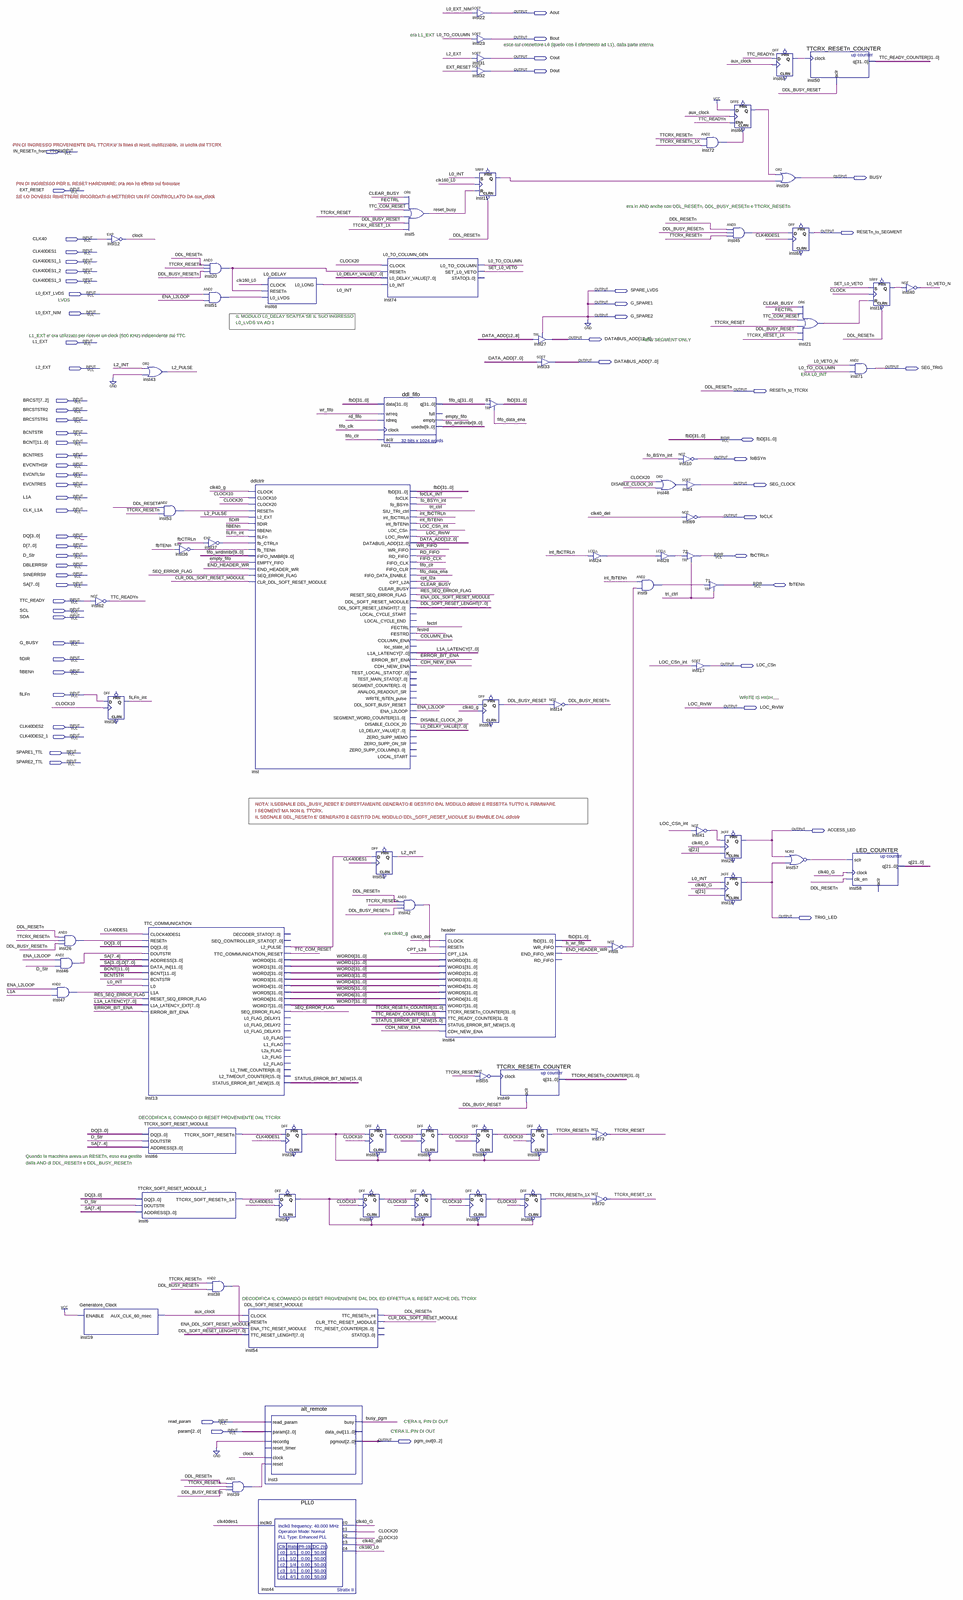
[diagram p0: schematic sheet, whole]
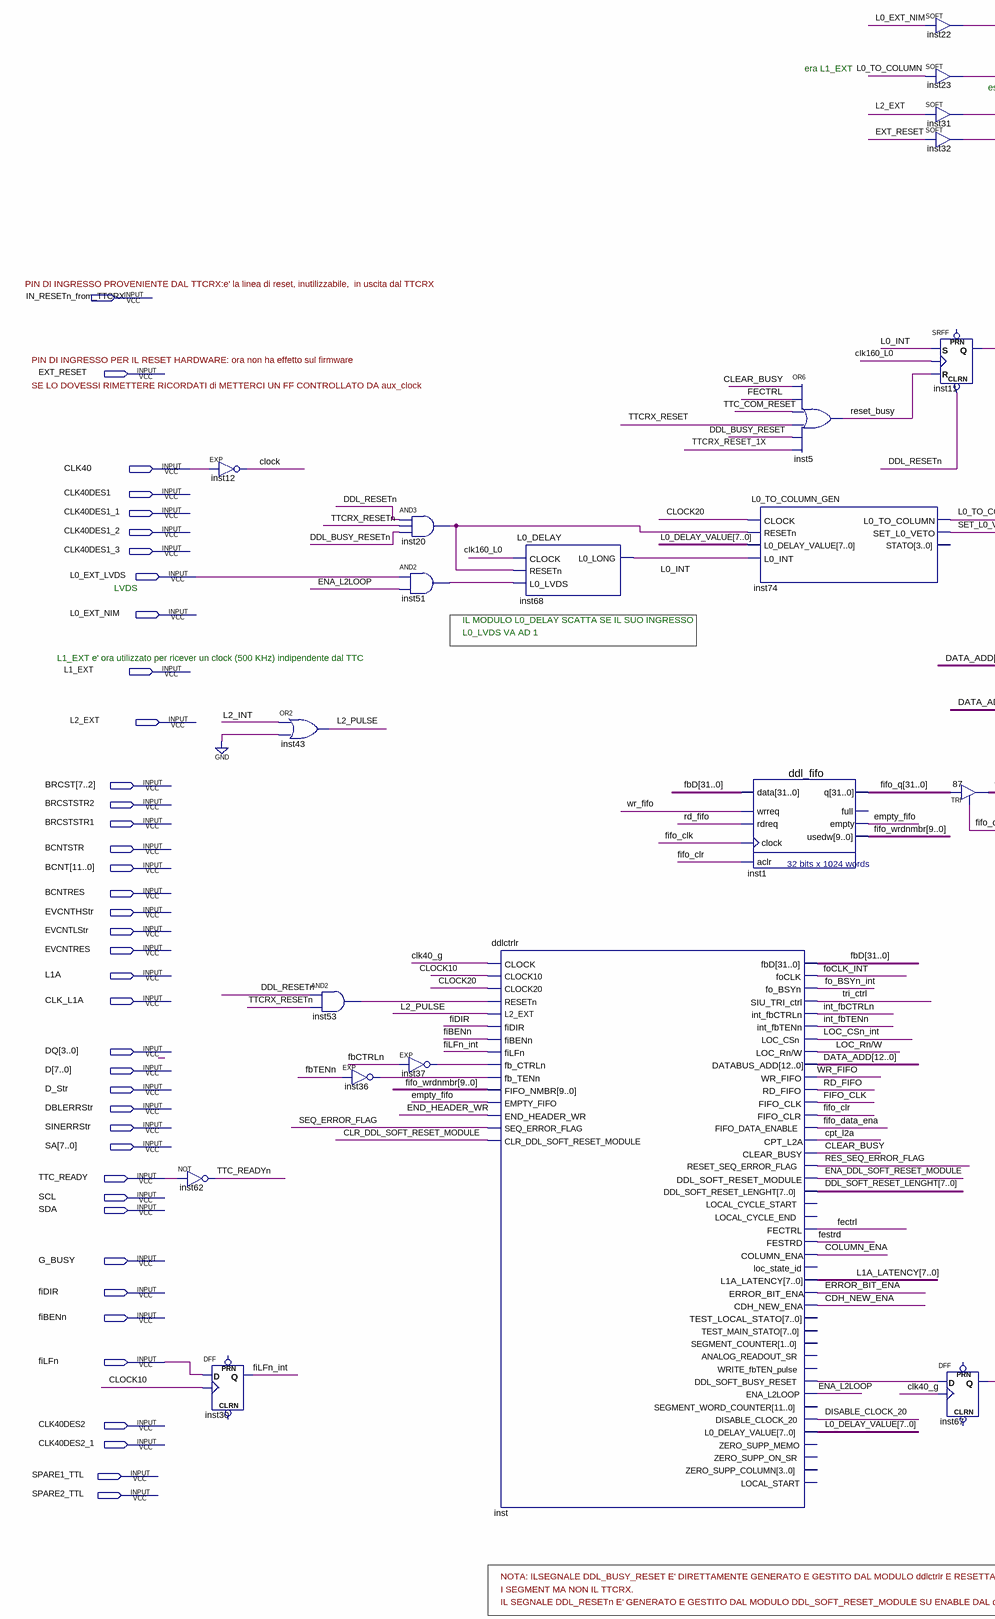
[diagram p1: schematic sheet, upper left part]
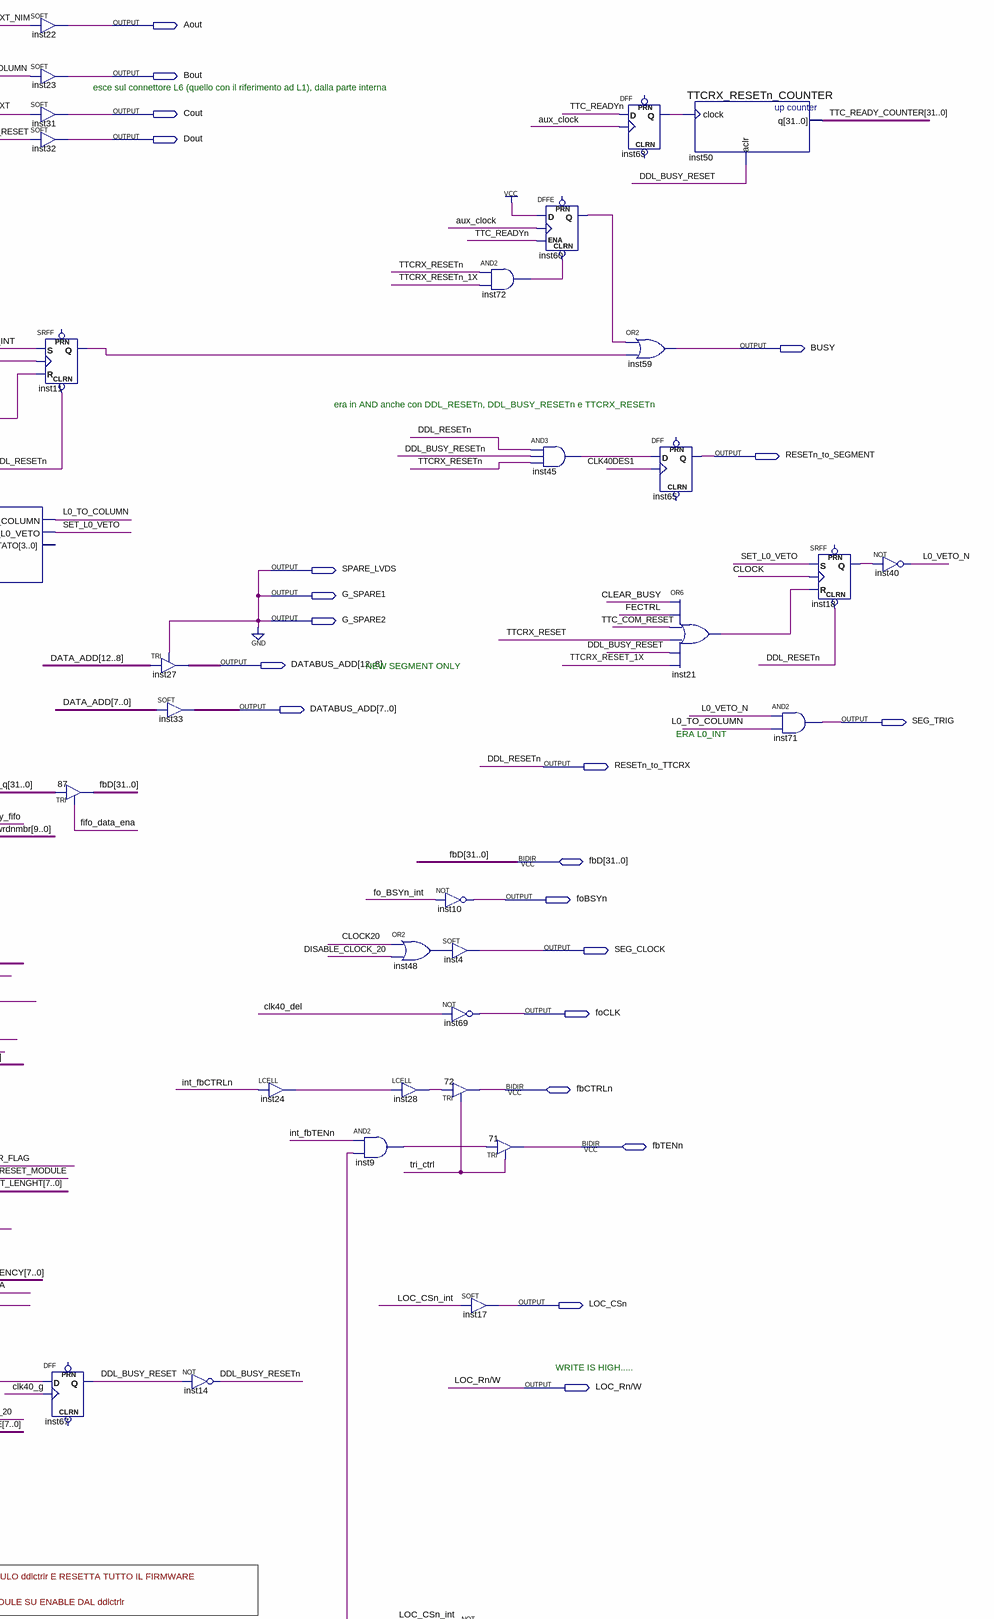
[diagram p2: schematic sheet, upper right part]
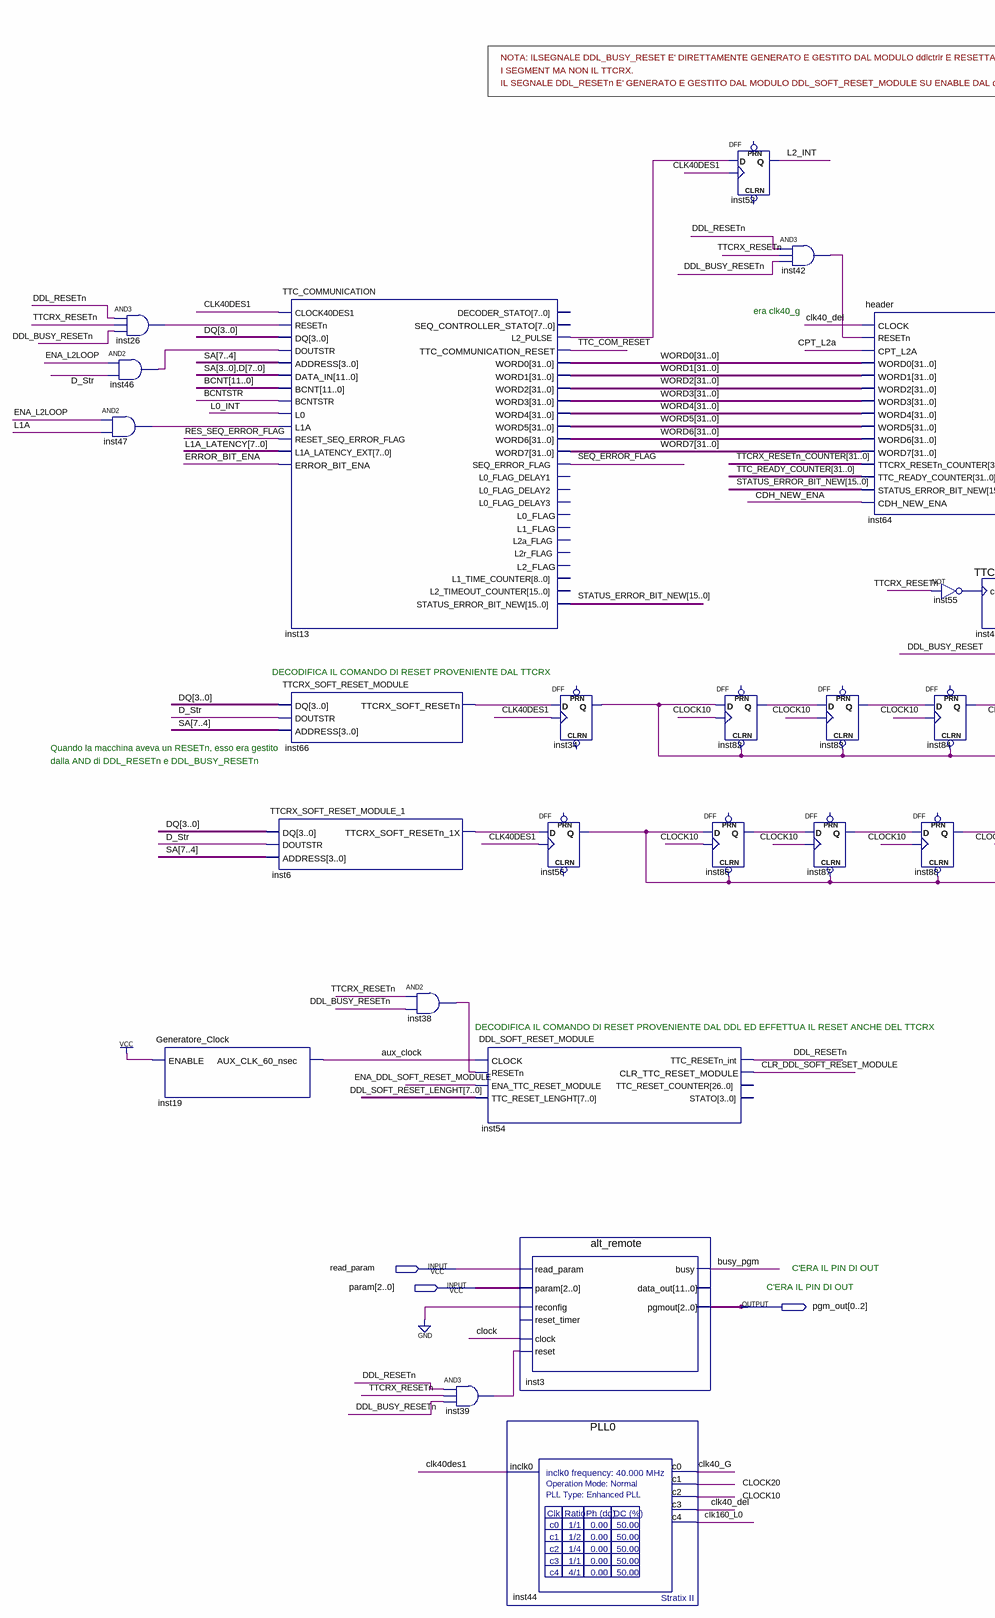
[diagram p3: schematic sheet, lower left part]
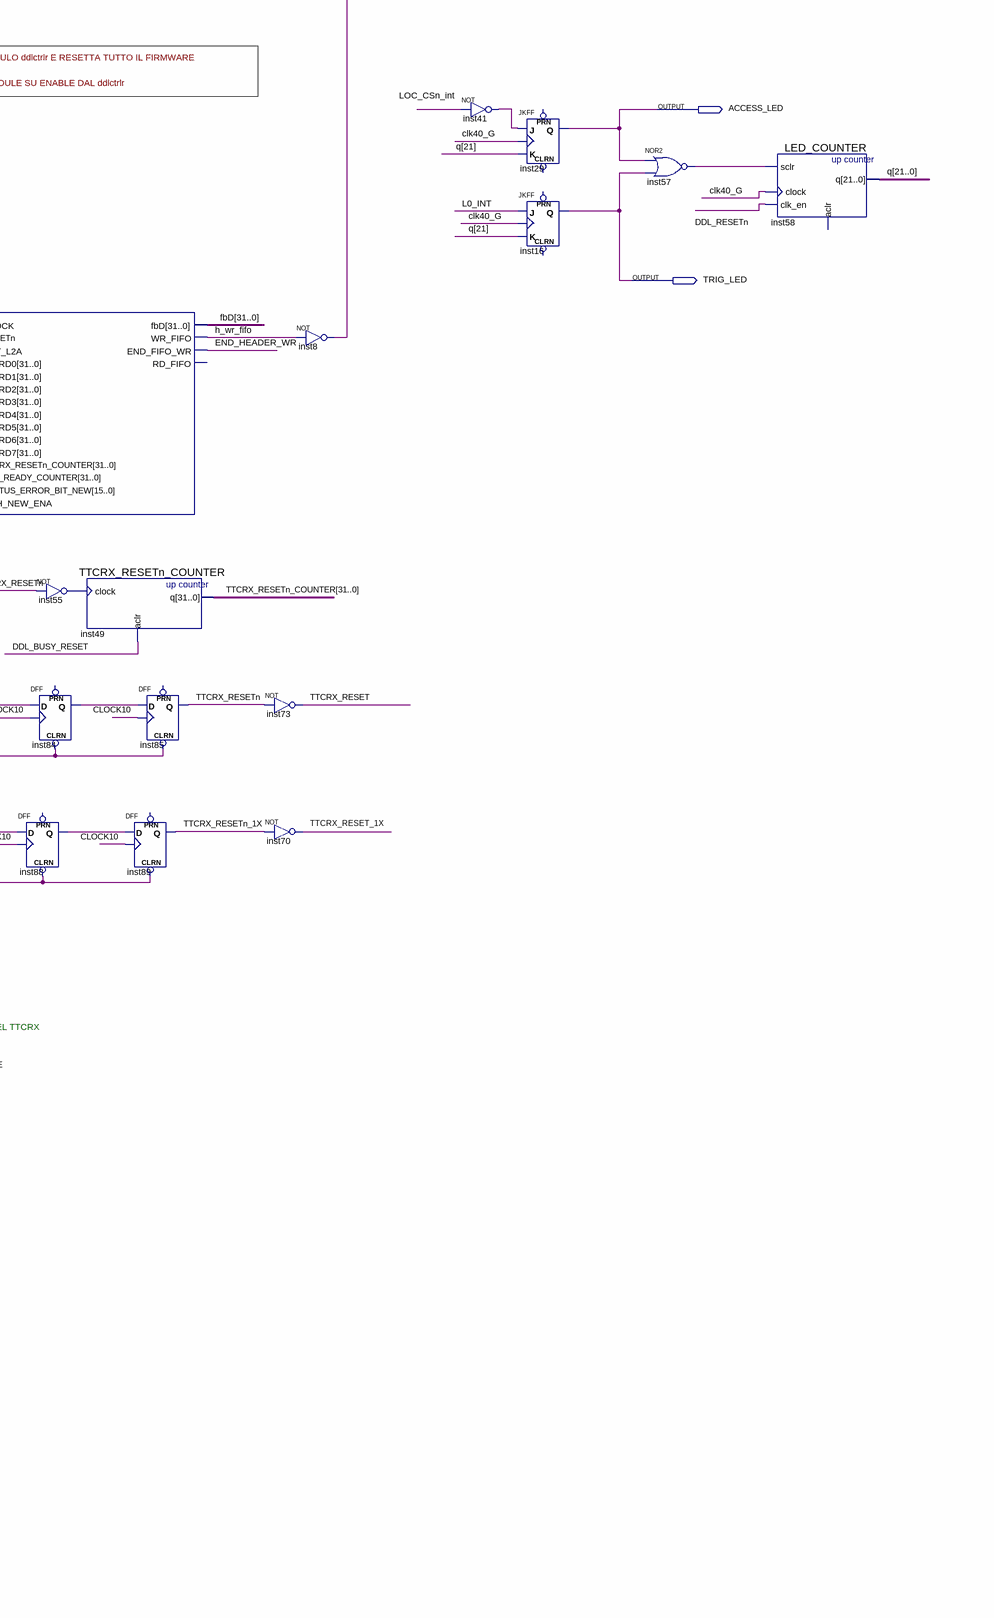
[diagram p4: schematic sheet, lower right part]
// Quartus schematic ddl_ctrlr.bdf as structural Verilog: 80 symbols, 65 pins
module ddl_ctrlr (
  input  IN_RESETn_from_TTCRX,
  input  EXT_RESET,
  input  CLK40,
  input  CLK40DES1,
  input  CLK40DES1_1,
  input  CLK40DES1_2,
  input  CLK40DES1_3,
  input  L0_EXT_LVDS,
  input  L0_EXT_NIM,
  input  L1_EXT,
  input  L2_EXT,
  input  [7:2] BRCST,
  input  BRCSTSTR2,
  input  BRCSTSTR1,
  input  BCNTSTR,
  input  [11:0] BCNT,
  input  BCNTRES,
  input  EVCNTHStr,
  input  EVCNTLStr,
  input  EVCNTRES,
  input  L1A,
  input  CLK_L1A,
  input  [3:0] DQ,
  input  [7:0] D,
  input  D_Str,
  input  DBLERRStr,
  input  SINERRStr,
  input  [7:0] SA,
  input  TTC_READY,
  input  SCL,
  input  SDA,
  input  G_BUSY,
  input  fiDIR,
  input  fiBENn,
  input  fiLFn,
  input  CLK40DES2,
  input  CLK40DES2_1,
  input  SPARE1_TTL,
  input  SPARE2_TTL,
  input  read_param,
  input  [2:0] param,
  inout  [31:0] fbD,
  inout  fbCTRLn,
  inout  fbTENn,
  output Aout,
  output Bout,
  output Cout,
  output Dout,
  output BUSY,
  output RESETn_to_SEGMENT,
  output SPARE_LVDS,
  output G_SPARE1,
  output G_SPARE2,
  output [12:0] DATABUS_ADD,
  output SEG_TRIG,
  output RESETn_to_TTCRX,
  output foBSYn,
  output SEG_CLOCK,
  output foCLK,
  output LOC_CSn,
  output \LOC_Rn/W ,
  output ACCESS_LED,
  output TRIG_LED,
  output [0:2] pgm_out
);

  wire aux_clock, busy_pgm, CDH_NEW_ENA, CLEAR_BUSY, clk40_del, clk40_G, clk160_L0, clock, CLOCK10, CLOCK20,
       CLR_DDL_SOFT_RESET_MODULE, COLUMN_ENA, CPT_L2a, DDL_BUSY_RESET, DDL_BUSY_RESETn, DISABLE_CLOCK_20,
       empty_fifo, ENA_DDL_SOFT_RESET_MODULE, ENA_L2LOOP, END_HEADER_WR, ERROR_BIT_ENA, FECTRL, festrd,
       fifo_clk, fifo_clr, fifo_data_ena, fiLFn_int, fo_BSYn_int, foCLK_INT, h_wr_fifo,
       inst6_ttcrx_soft_resetn_1x, inst8_out, inst9_out, inst11_q, inst13_l2_pulse, inst18_q, inst20_out,
       inst21_out, inst24_out, inst26_out, inst28_out, inst34_q, inst36_out, inst37_out, inst38_out,
       inst39_out, inst41_out, inst42_out, inst45_out, inst46_out, inst47_out, inst48_out, inst51_out,
       inst53_out, inst55_out, inst56_q, inst57_out, inst60_q, inst63_q, inst66_ttcrx_soft_resetn,
       inst72_out, inst82_q, inst83_q, inst84_q, inst86_q, inst87_q, inst88_q, inst_ddl_soft_busy_reset,
       int_fbCTRLn, int_fbTENn, L0_INT, L0_TO_COLUMN, L0_VETO_N, L2_INT, L2_PULSE, LOC_CSn_int, rd_fifo,
       RES_SEQ_ERROR_FLAG, reset_busy, SEQ_ERROR_FLAG, SET_L0_VETO, tri_ctrl, TTC_COM_RESET, TTC_READYn,
       TTCRX_RESET, TTCRX_RESET_1X, TTCRX_RESETn, TTCRX_RESETn_1X, wr_fifo;
  wire [7:0] DDL_SOFT_RESET_LENGHT, L0_DELAY_VALUE, L1A_LATENCY;
  wire [9:0] fifo_wrdnmbr;
  wire [12:0] DATA_ADD;
  wire [15:0] STATUS_ERROR_BIT_NEW;
  wire [21:0] q;
  wire [31:0] fifo_q, TTC_READY_COUNTER, TTCRX_RESETn_COUNTER, WORD0, WORD1, WORD2, WORD3, WORD4, WORD5,
       WORD6, WORD7;

  and inst26 (inst26_out, RESETn_to_TTCRX, TTCRX_RESETn, DDL_BUSY_RESETn);
  and inst46 (inst46_out, ENA_L2LOOP, D_Str);
  and inst47 (inst47_out, ENA_L2LOOP, L1A);
  Generatore_Clock inst19 (.ENABLE(1'b1), .AUX_CLK_60_nsec(aux_clock));
  EXP inst12 (.IN(CLK40), .OUT(clock));
  not inst62 (TTC_READYn, TTC_READY);
  DFF inst30 (.CLK(CLOCK10), .D(fiLFn), .Q(fiLFn_int));  // open: CLRN, PRN
  TTCRX_SOFT_RESET_MODULE_1 inst6 (
    .DQ(DQ), .DOUTSTR(D_Str), .ADDRESS(SA[7:4]), .TTCRX_SOFT_RESETn_1X(inst6_ttcrx_soft_resetn_1x));
  or inst43 (L2_PULSE, L2_INT, 1'b0);
  and inst53 (inst53_out, RESETn_to_TTCRX, TTCRX_RESETn);
  TTC_COMMUNICATION inst13 (
    .CLOCK40DES1(CLK40DES1), .RESETn(inst26_out), .DQ(DQ), .DOUTSTR(inst46_out), .ADDRESS(SA[7:4]),
    .DATA_IN({SA[3:0], D}), .BCNT(BCNT), .BCNTSTR(BCNTSTR), .L0(L0_INT), .L1A(inst47_out),
    .RESET_SEQ_ERROR_FLAG(RES_SEQ_ERROR_FLAG), .L1A_LATENCY_EXT(L1A_LATENCY), .ERROR_BIT_ENA(ERROR_BIT_ENA),
    .L2_PULSE(inst13_l2_pulse), .TTC_COMMUNICATION_RESET(TTC_COM_RESET), .WORD0(WORD0), .WORD1(WORD1),
    .WORD2(WORD2), .WORD3(WORD3), .WORD4(WORD4), .WORD5(WORD5), .WORD6(WORD6), .WORD7(WORD7),
    .SEQ_ERROR_FLAG(SEQ_ERROR_FLAG), .STATUS_ERROR_BIT_NEW(STATUS_ERROR_BIT_NEW));  // open: DECODER_STATO, SEQ_CONTROLLER_STATO, L0_FLAG_DELAY1, L0_FLAG_DELAY2, L0_FLAG_DELAY3, L0_FLAG, L1_FLAG, L2a_FLAG, L2r_FLAG, L2_FLAG, L1_TIME_COUNTER, L2_TIMEOUT_COUNTER
  TTCRX_SOFT_RESET_MODULE inst66 (
    .DQ(DQ), .DOUTSTR(D_Str), .ADDRESS(SA[7:4]), .TTCRX_SOFT_RESETn(inst66_ttcrx_soft_resetn));
  EXP inst36 (.IN(fbTENn), .OUT(inst36_out));
  and inst20 (inst20_out, RESETn_to_TTCRX, TTCRX_RESETn, DDL_BUSY_RESETn);
  and inst51 (inst51_out, L0_EXT_LVDS, ENA_L2LOOP);
  EXP inst37 (.IN(fbCTRLn), .OUT(inst37_out));
  and inst38 (inst38_out, TTCRX_RESETn, DDL_BUSY_RESETn);
  DDL_SOFT_RESET_MODULE inst54 (
    .CLOCK(aux_clock), .RESETn(inst38_out), .ENA_TTC_RESET_MODULE(ENA_DDL_SOFT_RESET_MODULE),
    .TTC_RESET_LENGHT(DDL_SOFT_RESET_LENGHT), .TTC_RESETn_int(RESETn_to_TTCRX),
    .CLR_TTC_RESET_MODULE(CLR_DDL_SOFT_RESET_MODULE));  // open: TTC_RESET_COUNTER, STATO
  and inst39 (inst39_out, RESETn_to_TTCRX, TTCRX_RESETn, DDL_BUSY_RESETn);
  L0_DELAY inst68 (.CLOCK(clk160_L0), .RESETn(inst20_out), .L0_LVDS(inst51_out), .L0_LONG(L0_INT));
  ddlctrlr inst (
    .CLOCK(clk40_G), .CLOCK10(CLOCK10), .CLOCK20(CLOCK20), .RESETn(inst53_out), .L2_EXT(L2_PULSE),
    .fiDIR(fiDIR), .fiBENn(fiBENn), .fiLFn(fiLFn_int), .fb_CTRLn(inst37_out), .fb_TENn(inst36_out),
    .FIFO_NMBR(fifo_wrdnmbr), .EMPTY_FIFO(empty_fifo), .END_HEADER_WR(END_HEADER_WR),
    .SEQ_ERROR_FLAG(SEQ_ERROR_FLAG), .CLR_DDL_SOFT_RESET_MODULE(CLR_DDL_SOFT_RESET_MODULE),
    .foCLK(foCLK_INT), .fo_BSYn(fo_BSYn_int), .SIU_TRI_ctrl(tri_ctrl), .int_fbCTRLn(int_fbCTRLn),
    .int_fbTENn(int_fbTENn), .LOC_CSn(LOC_CSn_int), .\LOC_Rn/W (\LOC_Rn/W ), .DATABUS_ADD(DATA_ADD),
    .WR_FIFO(wr_fifo), .RD_FIFO(rd_fifo), .FIFO_CLK(fifo_clk), .FIFO_CLR(fifo_clr),
    .FIFO_DATA_ENABLE(fifo_data_ena), .CPT_L2A(CPT_L2a), .CLEAR_BUSY(CLEAR_BUSY),
    .RESET_SEQ_ERROR_FLAG(RES_SEQ_ERROR_FLAG), .DDL_SOFT_RESET_MODULE(ENA_DDL_SOFT_RESET_MODULE),
    .DDL_SOFT_RESET_LENGHT(DDL_SOFT_RESET_LENGHT), .FECTRL(FECTRL), .FESTRD(festrd), .COLUMN_ENA(COLUMN_ENA),
    .L1A_LATENCY(L1A_LATENCY), .ERROR_BIT_ENA(ERROR_BIT_ENA), .CDH_NEW_ENA(CDH_NEW_ENA),
    .DDL_SOFT_BUSY_RESET(inst_ddl_soft_busy_reset), .ENA_L2LOOP(ENA_L2LOOP),
    .DISABLE_CLOCK_20(DISABLE_CLOCK_20), .L0_DELAY_VALUE(L0_DELAY_VALUE), .fbD(fbD));  // open: LOCAL_CYCLE_START, LOCAL_CYCLE_END, loc_state_id, TEST_LOCAL_STATO, TEST_MAIN_STATO, SEGMENT_COUNTER, ANALOG_READOUT_SR, WRITE_fbTEN_pulse, SEGMENT_WORD_COUNTER, ZERO_SUPP_MEMO, ZERO_SUPP_ON_SR, ZERO_SUPP_COLUMN, LOCAL_START
  alt_remote inst3 (
    .read_param(read_param), .param(param), .reconfig(1'b0), .clock(clock), .reset(inst39_out),
    .busy(busy_pgm), .pgmout(pgm_out));  // open: reset_timer, data_out
  PLL0 inst44 (.inclk0(CLK40DES1), .c0(clk40_G), .c1(CLOCK20), .c2(CLOCK10), .c3(clk40_del), .c4(clk160_L0));
  DFF inst34 (.CLK(CLK40DES1), .D(inst66_ttcrx_soft_resetn), .Q(inst34_q));  // open: CLRN, PRN
  DFF inst56 (.CLK(CLK40DES1), .D(inst6_ttcrx_soft_resetn_1x), .Q(inst56_q));  // open: CLRN, PRN
  DFF inst52 (.CLK(CLK40DES1), .D(inst13_l2_pulse), .Q(L2_INT));  // open: CLRN, PRN
  DFF inst82 (.CLRN(inst34_q), .CLK(CLOCK10), .D(inst34_q), .Q(inst82_q));  // open: PRN
  DFF inst86 (.CLRN(inst56_q), .CLK(CLOCK10), .D(inst56_q), .Q(inst86_q));  // open: PRN
  L0_TO_COLUMN_GEN inst74 (
    .CLOCK(CLOCK20), .RESETn(inst20_out), .L0_DELAY_VALUE(L0_DELAY_VALUE), .L0_INT(L0_INT),
    .L0_TO_COLUMN(L0_TO_COLUMN), .SET_L0_VETO(SET_L0_VETO));  // open: STATO
  ddl_fifo inst1 (
    .data(fbD), .wrreq(wr_fifo), .rdreq(rd_fifo), .clock(fifo_clk), .aclr(fifo_clr), .q(fifo_q),
    .empty(empty_fifo), .usedw(fifo_wrdnmbr));  // open: full
  and inst42 (inst42_out, RESETn_to_TTCRX, TTCRX_RESETn, DDL_BUSY_RESETn);
  or inst5 (reset_busy, CLEAR_BUSY, FECTRL, TTC_COM_RESET, TTCRX_RESET, DDL_BUSY_RESET, TTCRX_RESET_1X);
  DFF inst83 (.CLRN(inst34_q), .CLK(CLOCK10), .D(inst82_q), .Q(inst83_q));  // open: PRN
  DFF inst87 (.CLRN(inst56_q), .CLK(CLOCK10), .D(inst86_q), .Q(inst87_q));  // open: PRN
  header inst64 (
    .CLOCK(clk40_del), .RESETn(inst42_out), .CPT_L2A(CPT_L2a), .WORD0(WORD0), .WORD1(WORD1), .WORD2(WORD2),
    .WORD3(WORD3), .WORD4(WORD4), .WORD5(WORD5), .WORD6(WORD6), .WORD7(WORD7),
    .TTCRX_RESETn_COUNTER(TTCRX_RESETn_COUNTER), .TTC_READY_COUNTER(TTC_READY_COUNTER),
    .STATUS_ERROR_BIT_NEW(STATUS_ERROR_BIT_NEW), .CDH_NEW_ENA(CDH_NEW_ENA), .WR_FIFO(h_wr_fifo),
    .END_FIFO_WR(END_HEADER_WR), .fbD(fbD));  // open: RD_FIFO
  SOFT inst22 (.IN(L0_EXT_NIM), .OUT(Aout));
  SOFT inst23 (.IN(L0_TO_COLUMN), .OUT(Bout));
  SOFT inst31 (.IN(L2_EXT), .OUT(Cout));
  SOFT inst32 (.IN(EXT_RESET), .OUT(Dout));
  SRFF inst11 (.CLRN(RESETn_to_TTCRX), .S(L0_INT), .R(reset_busy), .CLK(clk160_L0), .Q(inst11_q));  // open: PRN
  not inst55 (inst55_out, TTCRX_RESETn);
  DFF inst84 (.CLRN(inst34_q), .CLK(CLOCK10), .D(inst83_q), .Q(inst84_q));  // open: PRN
  DFF inst88 (.CLRN(inst56_q), .CLK(CLOCK10), .D(inst87_q), .Q(inst88_q));  // open: PRN
  TRI u_87[31:0] (.IN(fifo_q), .OE(fifo_data_ena), .OUT(fbD));
  DFF inst67 (.CLK(clk40_G), .D(inst_ddl_soft_busy_reset), .Q(DDL_BUSY_RESET));  // open: CLRN, PRN
  TTCRX_RESETn_COUNTER inst49 (.clock(inst55_out), .aclr(DDL_BUSY_RESET), .q(TTCRX_RESETn_COUNTER));
  DFF inst85 (.CLRN(inst34_q), .CLK(CLOCK10), .D(inst84_q), .Q(TTCRX_RESETn));  // open: PRN
  DFF inst89 (.CLRN(inst56_q), .CLK(CLOCK10), .D(inst88_q), .Q(TTCRX_RESETn_1X));  // open: PRN
  TRI inst27[4:0] (.IN(DATA_ADD[12:8]), .OE(1'b0), .OUT(DATABUS_ADD[12:8]));
  SOFT inst33[7:0] (.IN(DATA_ADD[7:0]), .OUT(DATABUS_ADD[7:0]));
  not inst14 (DDL_BUSY_RESETn, DDL_BUSY_RESET);
  LCELL inst24 (.IN(int_fbCTRLn), .OUT(inst24_out));
  not inst73 (TTCRX_RESET, TTCRX_RESETn);
  not inst70 (TTCRX_RESET_1X, TTCRX_RESETn_1X);
  not inst8 (inst8_out, h_wr_fifo);
  or inst48 (inst48_out, CLOCK20, DISABLE_CLOCK_20);
  LCELL inst28 (.IN(inst24_out), .OUT(inst28_out));
  and inst9 (inst9_out, int_fbTENn, inst8_out);
  not inst10 (foBSYn, fo_BSYn_int);
  SOFT inst4 (.IN(inst48_out), .OUT(SEG_CLOCK));
  not inst69 (foCLK, clk40_del);
  TRI u_72 (.IN(inst28_out), .OE(tri_ctrl), .OUT(fbCTRLn));
  and inst72 (inst72_out, TTCRX_RESETn, TTCRX_RESETn_1X);
  TRI u_71 (.IN(inst9_out), .OE(tri_ctrl), .OUT(fbTENn));
  SOFT inst17 (.IN(LOC_CSn_int), .OUT(LOC_CSn));
  not inst41 (inst41_out, LOC_CSn_int);
  DFFE inst60 (.CLRN(inst72_out), .D(1'b1), .CLK(aux_clock), .ENA(TTC_READYn), .Q(inst60_q));  // open: PRN
  and inst45 (inst45_out, RESETn_to_TTCRX, DDL_BUSY_RESETn, TTCRX_RESETn);
  JKFF inst29 (.K(q[21]), .J(inst41_out), .CLK(clk40_G), .Q(ACCESS_LED));  // open: PRN, CLRN
  JKFF inst16 (.K(q[21]), .J(L0_INT), .CLK(clk40_G), .Q(TRIG_LED));  // open: PRN, CLRN
  DFF inst63 (.CLK(aux_clock), .D(TTC_READYn), .Q(inst63_q));  // open: CLRN, PRN
  or inst59 (BUSY, inst60_q, inst11_q);
  nor inst57 (inst57_out, ACCESS_LED, TRIG_LED);
  TTCRX_RESETn_COUNTER inst50 (.clock(inst63_q), .aclr(DDL_BUSY_RESET), .q(TTC_READY_COUNTER));
  DFF inst65 (.CLK(CLK40DES1), .D(inst45_out), .Q(RESETn_to_SEGMENT));  // open: CLRN, PRN
  or inst21 (inst21_out, CLEAR_BUSY, FECTRL, TTC_COM_RESET, TTCRX_RESET, DDL_BUSY_RESET, TTCRX_RESET_1X);
  and inst71 (SEG_TRIG, L0_VETO_N, L0_TO_COLUMN);
  LED_COUNTER inst58 (.sclr(inst57_out), .clock(clk40_G), .clk_en(RESETn_to_TTCRX), .q(q));  // open: aclr
  SRFF inst18 (.CLRN(RESETn_to_TTCRX), .S(SET_L0_VETO), .R(inst21_out), .CLK(clock), .Q(inst18_q));  // open: PRN
  not inst40 (L0_VETO_N, inst18_q);

  assign G_SPARE1 = 1'b0;
  assign G_SPARE2 = 1'b0;
  assign SPARE_LVDS = 1'b0;

  // Other names for the same wires on the sheet: DDL_RESETn = RESETn_to_TTCRX

  // Notes on the sheet:
  //   era L1_EXT
  //   esce sul connettore L6 (quello con il riferimento ad L1), dalla parte interna
  //   PIN DI INGRESSO PROVENIENTE DAL TTCRX:e' la linea di reset, inutilizzabile,  in uscita dal TTCRX
  //   PIN DI INGRESSO PER IL RESET HARDWARE: ora non ha effetto sul firmware
  //   SE LO DOVESSI RIMETTERE RICORDATI di METTERCI UN FF CONTROLLATO DA aux_clock
  //   era in AND anche con DDL_RESETn, DDL_BUSY_RESETn e TTCRX_RESETn
  //   LVDS
  //   IL MODULO L0_DELAY SCATTA SE IL SUO INGRESSO
  //   L0_LVDS VA AD 1
  //   L1_EXT e' ora utilizzato per ricever un clock (500 KHz) indipendente dal TTC
  //   NEW SEGMENT ONLY
  //   ERA L0_INT
  //   WRITE IS HIGH.....
  //   NOTA: ILSEGNALE DDL_BUSY_RESET E' DIRETTAMENTE GENERATO E GESTITO DAL MODULO ddlctrlr E RESETTA TUTTO IL FIRMWARE
  //   I SEGMENT MA NON IL TTCRX.
  //   IL SEGNALE DDL_RESETn E' GENERATO E GESTITO DAL MODULO DDL_SOFT_RESET_MODULE SU ENABLE DAL ddlctrlr
  //   era clk40_g
  //   DECODIFICA IL COMANDO DI RESET PROVENIENTE DAL TTCRX
  //   Quando la macchina aveva un RESETn, esso era gestito
  //   dalla AND di DDL_RESETn e DDL_BUSY_RESETn
  //   DECODIFICA IL COMANDO DI RESET PROVENIENTE DAL DDL ED EFFETTUA IL RESET ANCHE DEL TTCRX
  //   C'ERA IL PIN DI OUT
  //   C'ERA IL PIN DI OUT
endmodule
